# EasyEDA schematic nearsens-schematic-source-2026-05-26-draft.json
TITLE: NearSens - interconnect diagram; REV: 0.16.0; Date: 26-05-2026; Sheet: 1/2; Drawn By: Patryk Ankudowicz (Artisfera)
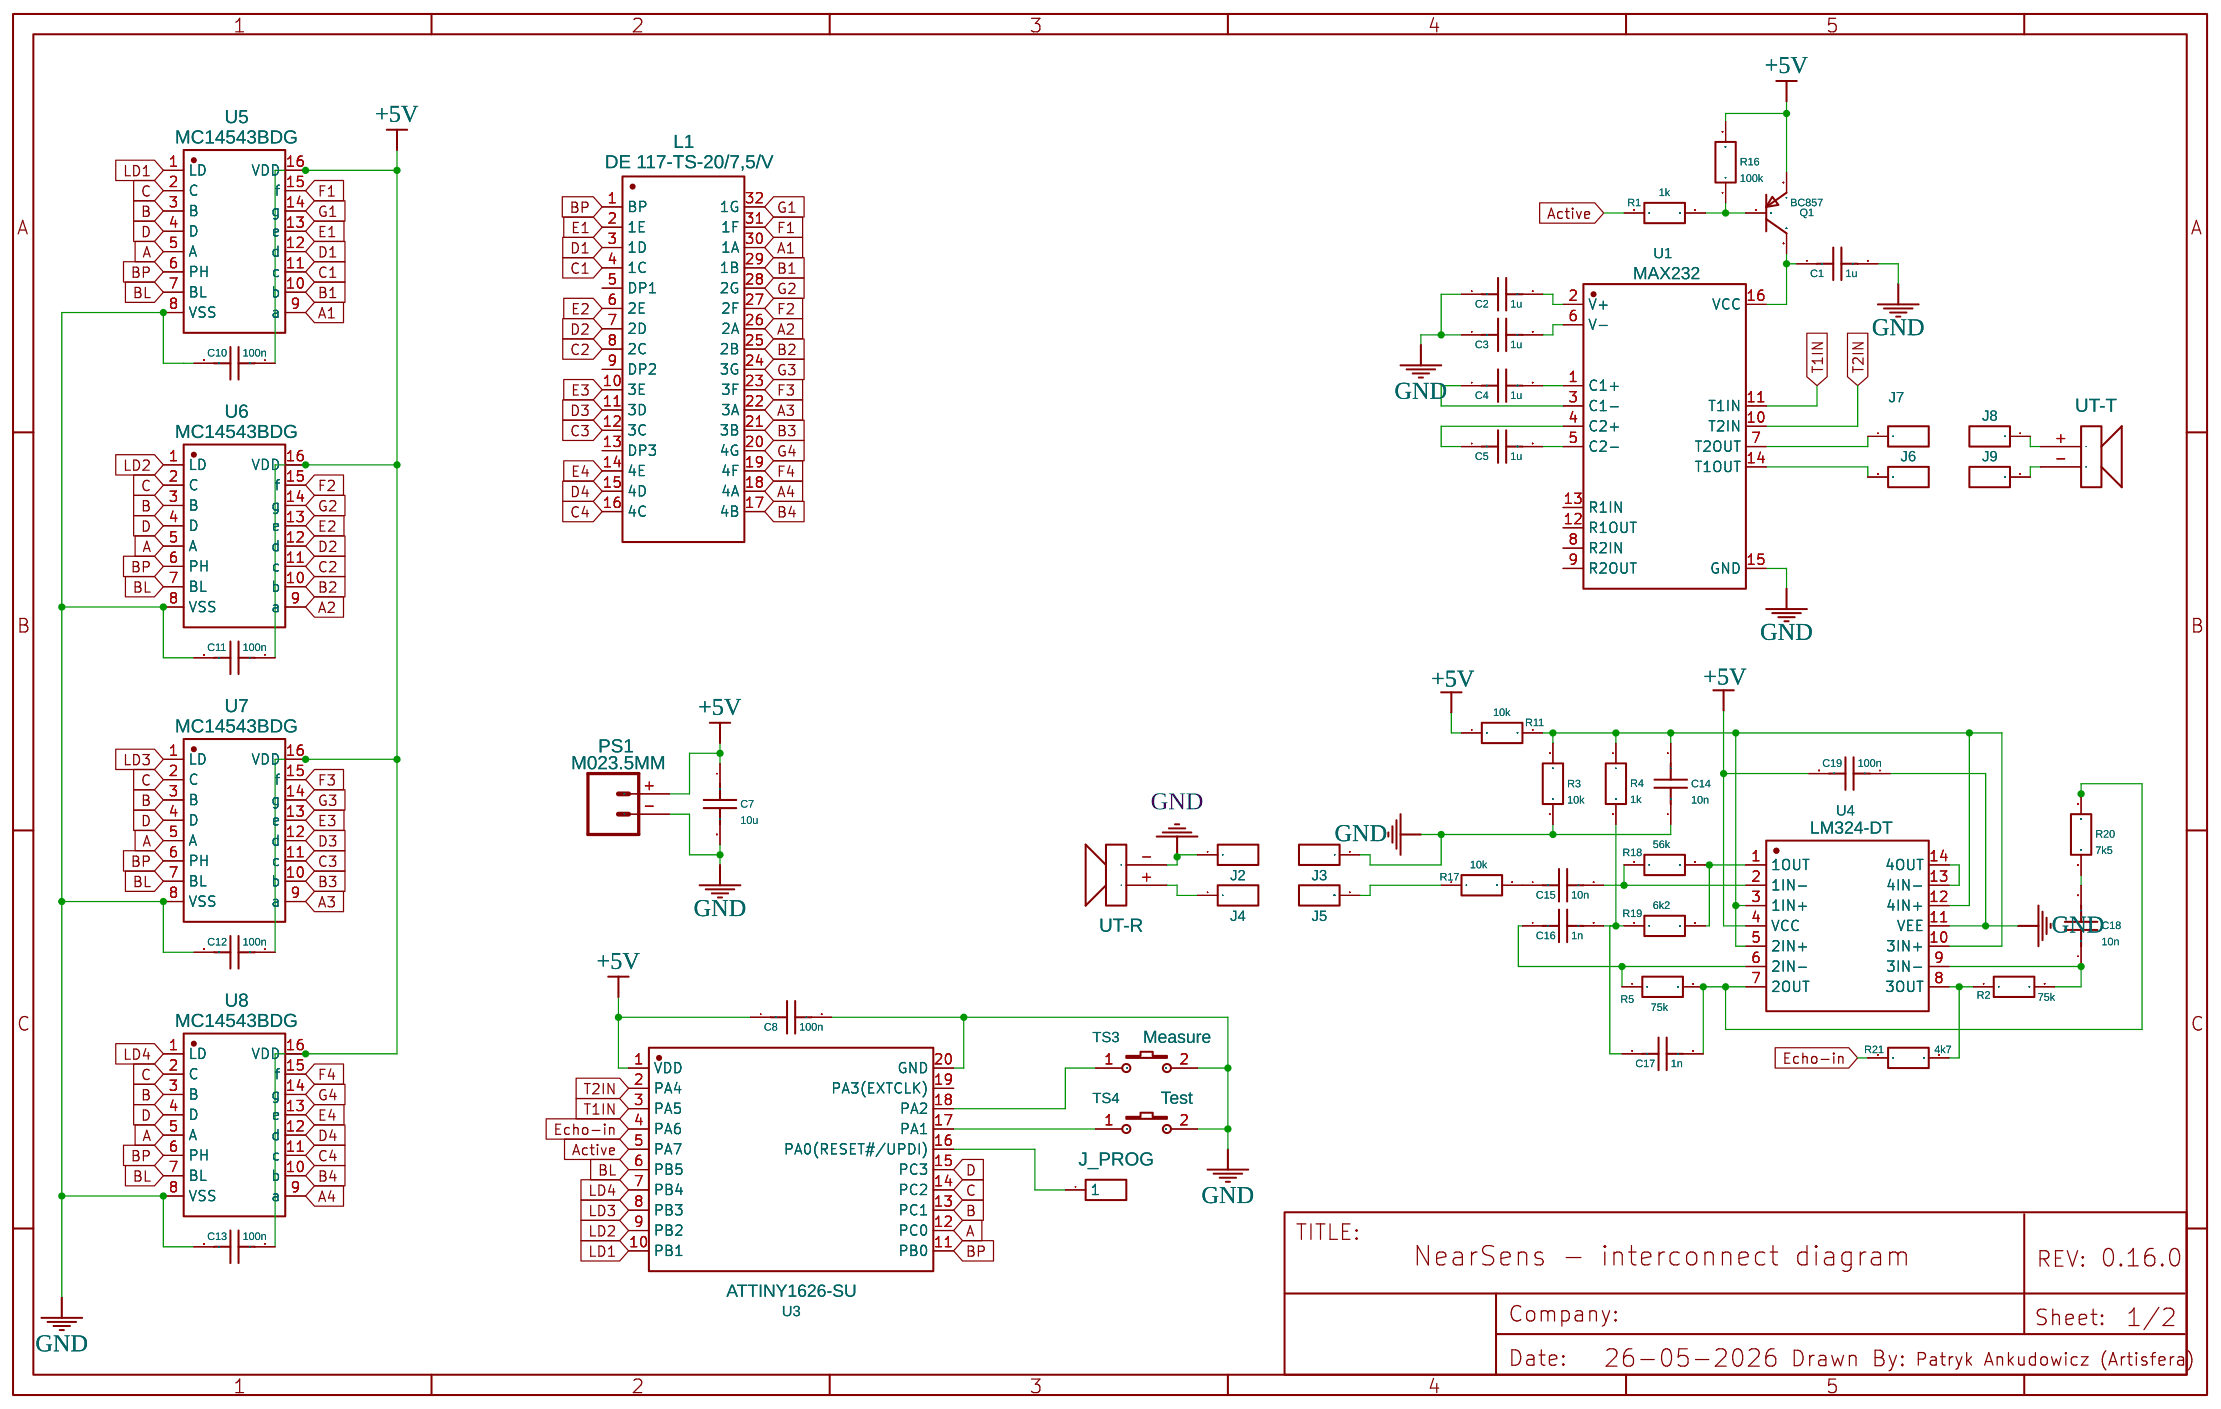
[diagram p0: schematic sheet]

## Parts
C1  1u  [C0805]
C2  1u  [C0805]
C3  1u  [C0805]
C4  1u  [C0805]
C5  1u  [C0805]
C7  10u  [C1206]
C8  100n  [C0603]
C10  100n  [C0603]
C11  100n  [C0603]
C12  100n  [C0603]
C13  100n  [C0603]
C14  10n  [C0603]
C15  10n  [C0603]
C16  1n  [C0603]
C17  1n  [C0603]
C18  10n  [C0603]
C19  100n  [C0603]
J2  HDR-M-2.54_1x1  [PAD]
J3  HDR-M-2.54_1x1  [PAD]
J4  HDR-M-2.54_1x1  [PAD]
J5  HDR-M-2.54_1x1  [PAD]
J6  HDR-M-2.54_1x1  [PAD]
J7  HDR-M-2.54_1x1  [PAD]
J8  HDR-M-2.54_1x1  [PAD]
J9  HDR-M-2.54_1x1  [PAD]
J_PROG  Programming  [PAD-2.54-X1]
L1  DE 117-TS-20/7,5/V  [DE 117-TS-20/7,5/V DISPLAY ELEKTRONIK - DISPLAY LCD]
PS1  M023.5MM  [SCREW-CONNECTOR-2,54]
Q1  BC857  [PG-SOT23-3_L2.9-W1.3-P1.90-LS2.4-BR]
R1  1k  [R0603]
R2  75k  [R0603]
R3  10k  [R0603]
R4  1k  [R0603]
R5  75k  [R0603]
R11  10k  [R0603]
R16  100k  [R0603]
R17  10k  [R0603]
R18  56k  [R0603]
R19  6k2  [R0603]
R20  7k5  [R0603]
R21  4k7  [R0603]
TS3  Measure  [TACT-SWITCH]
TS4  Test  [TACT-SWITCH]
U1  MAX232  [SOP-16_L10.2-W3.9-P1.27-LS6.0-BL]
U3  ATTINY1626-SU  [SOIC-20_L12.8-W7.5-P1.27-LS10.3-TL]
U4  LM324-DT  [SOP-14_L8.6-W3.9-P1.27-LS6.0-BL]
U5  MC14543BDG  [SOIC-16 D SUFFIX CASE 751B]
U6  MC14543BDG  [SOIC-16 D SUFFIX CASE 751B]
U7  MC14543BDG  [SOIC-16 D SUFFIX CASE 751B]
U8  MC14543BDG  [SOIC-16 D SUFFIX CASE 751B]
UT-R  Przetwornik ultradzwiekowy  [16MM-TRANSDUCER]
UT-T  Przetwornik ultradzwiekowy  [16MM-TRANSDUCER]

## Library data of the parts
C1-C5 C7 C8 C10-C19 = C_0603_US: Contributor: LCEDA_Lib
J2-J9 J_PROG = HDR-M-2.54_1x1: Supplier Part: C81276; Supplier: LCSC; Contributor: LCEDA_Lib
L1 = DE 117-TS-20/7,5/V DISPLAY ELEKTRONIK - Display LCD: Manufacturer: DISPLAY ELEKTRONIK; Contributor: ankudowiczpll08
PS1 = M023.5MM: Contributor: Paul Andrew Lafranchise
Q1 = BC557: Contributor: LCSC; Supplier Part: C180418; Supplier: LCSC; Manufacturer: CJ(江苏长电/长晶); Manufacturer Part: BC557(RANGE:420-800); JLCPCB Part Class: Extended Part
R1-R5 R11 R16-R21 = R_0603_EU: Contributor: LCEDA_Lib
TS3 TS4 = K2-3.6×6.1_SMD: Supplier Part: C118141; Supplier: LCSC; Manufacturer Part: K2-1107ST-A4SW-06; Contributor: LCEDA_Lib; 制造商: 韩国韩荣
U1 = MAX232ESE-EV: Supplier: LCSC; Supplier Part: C28642202; Manufacturer: EVVO(翊欧); JLCPCB Part Class: Extended Part; Contributor: lcsc
U3 = ATTINY1626-SU: Supplier: Mouser; Supplier Part: 556-ATTINY1626-SU; Manufacturer: MICROCHIP(美国微芯); JLCPCB Part Class: Extended Part; Contributor: mikel.espinosa; link: https://www.mouser.es/datasheet/2/268/ATtiny1624_26_27_DataSheet_DS40002234B-2887710.pdf
U4 = LM324-DW: Supplier: LCSC; Supplier Part: C47355689; Manufacturer: DOWO(东沃); Contributor: lcsc; JLCPCB Part Class: Extended Part
U5-U8 = MC14543BDG: Contributor: ankudowiczpll08
UT-R UT-T = ULTRASONIC TRANSDUCER: Manufacturer: I47; Manufacturer Part: I47123; Supplier: I47; Supplier Part: I471; Contributor: i47

## Nets
+5V: C7.1 C8.1 C10.1 C11.1 C12.1 C13.1 C19.2 PS1.+(2) Q1.2(E) R11.1 R16.2 U3.1(VDD) U4.4(VCC) U5.16(VDD) U6.16(VDD) U7.16(VDD) U8.16(VDD)
GND: C1.2 C2.1 C3.1 C7.2 C8.2 C10.2 C11.2 C12.2 C13.2 C14.1 C19.1 J2.1 J3.1 PS1.-(1) R3.1 TS3.2 TS4.2 U1.15(GND) U3.20(GND) U4.11(VEE) U5.8(VSS) U6.8(VSS) U7.8(VSS) U8.8(VSS) UT-R.-(+)
A: U3.12(PC0) U5.5(A) U6.5(A) U7.5(A) U8.5(A)
A1: L1.30(1A) U5.9(a)
A2: L1.26(2A) U6.9(a)
A3: L1.22(3A) U7.9(a)
A4: L1.18(4A) U8.9(a)
Active: R1.1 U3.5(PA7)
B: U3.13(PC1) U5.3(B) U6.3(B) U7.3(B) U8.3(B)
B1: L1.29(1B) U5.10(b)
B2: L1.25(2B) U6.10(b)
B3: L1.21(3B) U7.10(b)
B4: L1.17(4B) U8.10(b)
BL: U3.6(PB5) U5.7(BL) U6.7(BL) U7.7(BL) U8.7(BL)
BP: L1.1(BP) U3.11(PB0) U5.6(PH) U6.6(PH) U7.6(PH) U8.6(PH)
C: U3.14(PC2) U5.2(C) U6.2(C) U7.2(C) U8.2(C)
C1: L1.4(1C) U5.11(c)
C2: L1.8(2C) U6.11(c)
C3: L1.12(3C) U7.11(c)
C4: L1.16(4C) U8.11(c)
D: U3.15(PC3) U5.4(D) U6.4(D) U7.4(D) U8.4(D)
D1: L1.3(1D) U5.12(d)
D2: L1.7(2D) U6.12(d)
D3: L1.11(3D) U7.12(d)
D4: L1.15(4D) U8.12(d)
E1: L1.2(1E) U5.13(e)
E2: L1.6(2E) U6.13(e)
E3: L1.10(3E) U7.13(e)
E4: L1.14(4E) U8.13(e)
Echo-in: R21.1 U3.4(PA6)
F1: L1.31(1F) U5.15(f)
F2: L1.27(2F) U6.15(f)
F3: L1.23(3F) U7.15(f)
F4: L1.19(4F) U8.15(f)
G1: L1.32(1G) U5.14(g)
G2: L1.28(2G) U6.14(g)
G3: L1.24(3G) U7.14(g)
G4: L1.20(4G) U8.14(g)
LD1: U3.10(PB1) U5.1(LD)
LD2: U3.9(PB2) U6.1(LD)
LD3: U3.8(PB3) U7.1(LD)
LD4: U3.7(PB4) U8.1(LD)
T1IN: U1.11(T1IN) U3.3(PA5)
T2IN: U1.10(T2IN) U3.2(PA4)
Net-(C1-1): C1.1 Q1.3(C) U1.16(VCC)
Net-(C2-2): C2.2 U1.2(V+)
Net-(C3-2): C3.2 U1.6(V-)
Net-(C4-1): C4.1 U1.3(C1-)
Net-(C4-2): C4.2 U1.1(C1+)
Net-(C5-1): C5.1 U1.4(C2+)
Net-(C5-2): C5.2 U1.5(C2-)
Net-(C14-2): C14.2 R3.2 R4.1 R11.2 U4.3(1IN+) U4.5(2IN+) U4.10(3IN+) U4.12(4IN+)
Net-(C15-1): C15.1 R17.2
Net-(C15-2): C15.2 R18.1 U4.2(1IN-)
Net-(C16-1): C16.1 R5.1 U4.6(2IN-)
Net-(C16-2): C16.2 C17.1 R4.2 R19.1
Net-(C17-2): C17.2 R5.2 R20.2 U4.7(2OUT)
Net-(C18-1): C18.1 R2.2 U4.9(3IN-)
Net-(C18-2): C18.2 R20.1
Net-(J4-1): J4.1 UT-R.+(-)
Net-(J5-1): J5.1(PAD) R17.1
Net-(J6-1): J6.1 U1.14(T1OUT)
Net-(J7-1): J7.1 U1.7(T2OUT)
Net-(J8-1): J8.1 UT-T.+(-)
Net-(J9-1): J9.1 UT-T.-(+)
Net-(J_PROG-1): J_PROG.1 U3.16(PA0(RESET#/UPDI))
Net-(Q1-1): Q1.1(B) R1.2 R16.1
Net-(R2-1): R2.1 R21.2 U4.8(3OUT)
Net-(R18-2): R18.2 R19.2 U4.1(1OUT)
Net-(TS3-1): TS3.1 U3.18(PA2)
Net-(TS4-1): TS4.1 U3.17(PA1)
Net-(U4-13): U4.13(4IN-) U4.14(4OUT)

Not connected (* = marked no-connect by the designer): L1 5(DP1) 9(DP2) 13(DP3); U1 8(R2IN) 9(R2OUT) 12(R1OUT) 13(R1IN); U3 19(PA3(EXTCLK))
